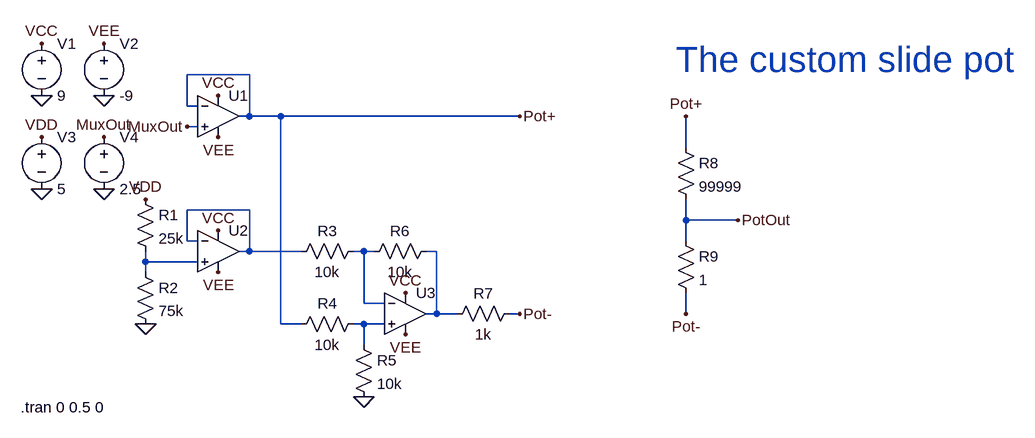
[diagram p0: schematic Power.asc]
Power.asc, the LTspice schematic file:
Version 4.1
SHEET 1 1120 680
WIRE 224 64 128 64
WIRE 128 112 128 64
WIRE 144 112 128 112
WIRE 224 128 224 64
WIRE 224 128 208 128
WIRE 272 128 224 128
WIRE 640 128 272 128
WIRE 144 144 128 144
WIRE 896 176 896 128
WIRE 224 272 128 272
WIRE 896 288 896 256
WIRE 976 288 896 288
WIRE 128 320 128 272
WIRE 144 320 128 320
WIRE 896 320 896 288
WIRE 224 336 224 272
WIRE 224 336 208 336
WIRE 304 336 224 336
WIRE 400 336 384 336
WIRE 416 336 400 336
WIRE 512 336 496 336
WIRE 64 352 64 336
WIRE 144 352 64 352
WIRE 64 368 64 352
WIRE 400 416 400 336
WIRE 432 416 400 416
WIRE 512 432 512 336
WIRE 512 432 496 432
WIRE 544 432 512 432
WIRE 640 432 624 432
WIRE 896 432 896 400
WIRE 272 448 272 128
WIRE 304 448 272 448
WIRE 400 448 384 448
WIRE 432 448 400 448
WIRE 400 480 400 448
FLAG 128 144 MuxOut
FLAG -96 96 0
FLAG 0 96 0
FLAG -96 16 VCC
FLAG 0 16 VEE
FLAG 176 160 VEE
FLAG 176 96 VCC
FLAG 176 368 VEE
FLAG 176 304 VCC
FLAG -96 240 0
FLAG -96 160 VDD
FLAG 64 448 0
FLAG 64 256 VDD
FLAG 400 560 0
FLAG 464 400 VCC
FLAG 464 464 VEE
FLAG 640 432 Pot-
FLAG 640 128 Pot+
FLAG 896 128 Pot+
FLAG 896 432 Pot-
FLAG 976 288 PotOut
FLAG 0 240 0
FLAG 0 160 MuxOut
SYMBOL OpAmps\\UniversalOpAmp2 176 128 R0
SYMATTR InstName U1
SYMBOL voltage -96 0 R0
WINDOW 123 0 0 Left 0
WINDOW 39 0 0 Left 0
SYMATTR InstName V1
SYMATTR Value 9
SYMBOL voltage 0 0 R0
WINDOW 123 0 0 Left 0
WINDOW 39 0 0 Left 0
SYMATTR InstName V2
SYMATTR Value -9
SYMBOL OpAmps\\UniversalOpAmp2 176 336 R0
SYMATTR InstName U2
SYMBOL voltage -96 144 R0
WINDOW 123 0 0 Left 0
WINDOW 39 0 0 Left 0
SYMATTR InstName V3
SYMATTR Value 5
SYMBOL res 48 240 R0
SYMATTR InstName R1
SYMATTR Value 25k
SYMBOL res 48 352 R0
SYMATTR InstName R2
SYMATTR Value 75k
SYMBOL res 400 320 R90
WINDOW 0 0 56 VBottom 2
WINDOW 3 32 56 VTop 2
SYMATTR InstName R3
SYMATTR Value 10k
SYMBOL res 400 432 R90
WINDOW 0 0 56 VBottom 2
WINDOW 3 32 56 VTop 2
SYMATTR InstName R4
SYMATTR Value 10k
SYMBOL OpAmps\\UniversalOpAmp2 464 432 R0
SYMATTR InstName U3
SYMBOL res 384 464 R0
SYMATTR InstName R5
SYMATTR Value 10k
SYMBOL res 512 320 R90
WINDOW 0 0 56 VBottom 2
WINDOW 3 32 56 VTop 2
SYMATTR InstName R6
SYMATTR Value 10k
SYMBOL res 640 416 R90
WINDOW 0 0 56 VBottom 2
WINDOW 3 32 56 VTop 2
SYMATTR InstName R7
SYMATTR Value 1k
SYMBOL res 880 160 R0
SYMATTR InstName R8
SYMATTR Value 99999
SYMBOL res 880 304 R0
SYMATTR InstName R9
SYMATTR Value 1
SYMBOL voltage 0 144 R0
WINDOW 123 0 0 Left 0
WINDOW 39 0 0 Left 0
SYMATTR InstName V4
SYMATTR Value 2.5
TEXT 880 40 Left 5 ;The custom slide pot
TEXT -128 576 Left 2 !.tran 0 0.5 0

The netlist it stands for:
* Power.asc
X§U1 MuxOut Pot+ VCC VEE Pot+ level2 Avol=1Meg GBW=10Meg Slew=10Meg Ilimit=25m Rail=0 Vos=0 En=0 Enk=0 In=0 Ink=0 Rin=500Meg  ; pins In+ In- V+ V- OUT
V1 VCC 0 9
V2 VEE 0 -9
X§U2 N004 N001 VCC VEE N001 level2 Avol=1Meg GBW=10Meg Slew=10Meg Ilimit=25m Rail=0 Vos=0 En=0 Enk=0 In=0 Ink=0 Rin=500Meg  ; pins In+ In- V+ V- OUT
V3 VDD 0 5
R1 VDD N004 25k
R2 N004 0 75k
R3 N002 N001 10k
R4 N005 Pot+ 10k
X§U3 N005 N002 VCC VEE N003 level2 Avol=1Meg GBW=10Meg Slew=10Meg Ilimit=25m Rail=0 Vos=0 En=0 Enk=0 In=0 Ink=0 Rin=500Meg  ; pins In+ In- V+ V- OUT
R5 N005 0 10k
R6 N003 N002 10k
R7 Pot- N003 1k
R8 Pot+ PotOut 99999
R9 PotOut Pot- 1
V4 MuxOut 0 2.5
* The custom slide pot
.tran 0 0.5 0
.lib UniversalOpAmp2.lib
.backanno
.end